# Altium schematic sheet cpu.SchDoc
size A
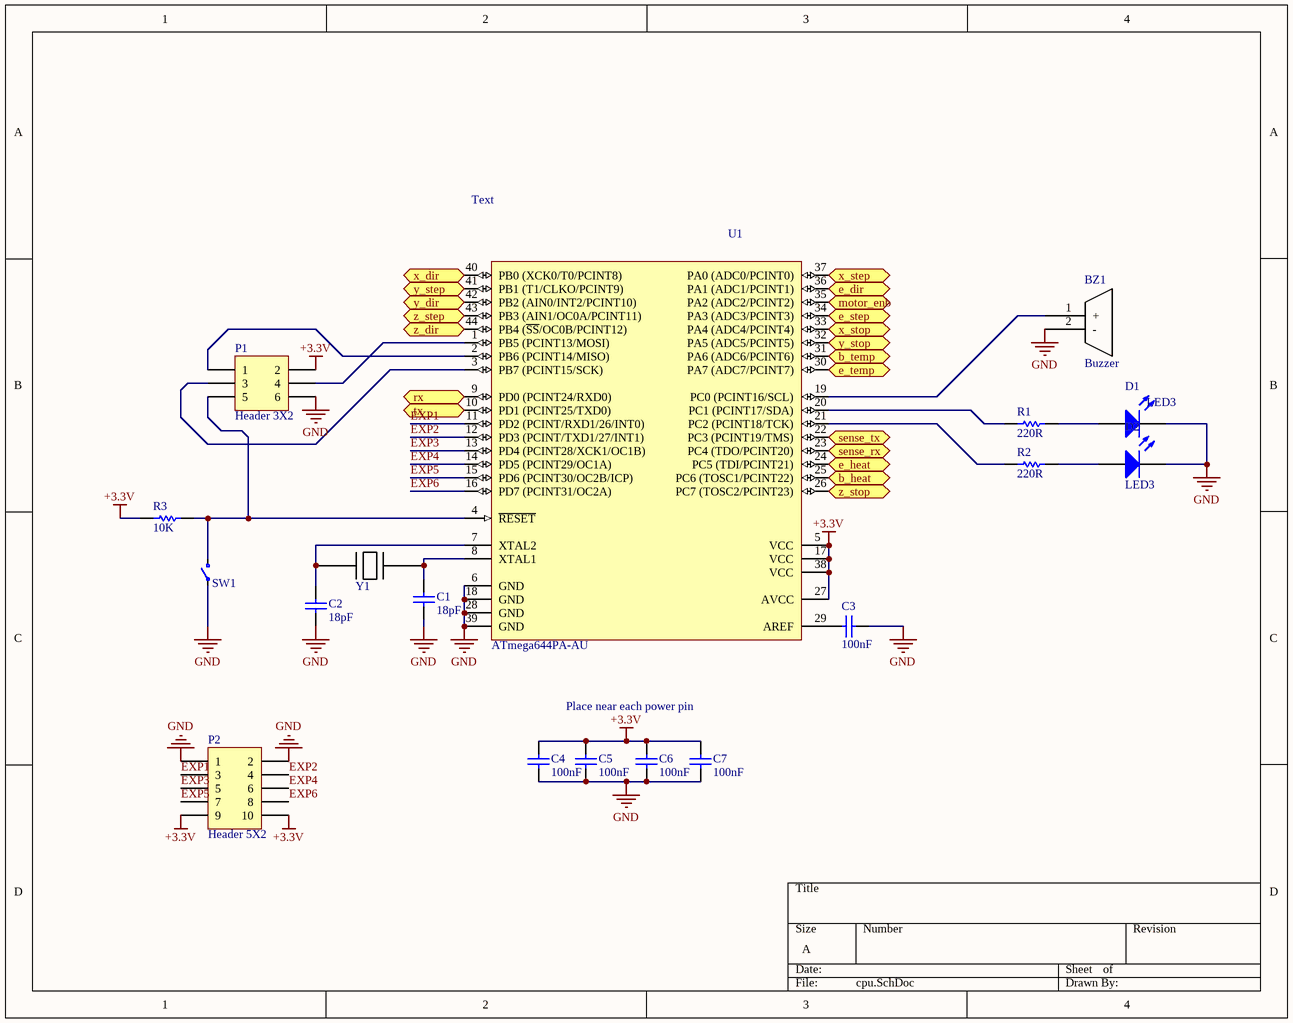
[diagram p0: cpu.SchDoc]

## Parts
BZ1  Buzzer  [buzzer]
C1  value 18pF  [CAPC2012L-3D]  (hidden comment: Cap)
C2  value 18pF  [CAPC2012L-3D]  (hidden comment: Cap)
C3  value 100nF  [1608[0603]]  (hidden comment: Cap)
C4  value 100nF  [1608[0603]]  (hidden comment: Cap)
C5  value 100nF  [1608[0603]]  (hidden comment: Cap)
C6  value 100nF  [1608[0603]]  (hidden comment: Cap)
C7  value 100nF  [1608[0603]]  (hidden comment: Cap)
D1  LED3  [LED 0805]
D2  LED3  [LED 0805]
P1  Header 3X2  [HDR2X3]
P2  Header 5X2  [HDR2X5]
R1  value 220R  [J1-0603]  (hidden comment: Res)
R2  value 220R  [J1-0603]  (hidden comment: Res)
R3  value 10K  [J1-0603]  (hidden comment: Res)
SW1  Tactile Switch 6mm  [Switch 6mm]  (value not drawn)
U1  ATmega644PA-AU  [44A_N]
Y1  ABMM2  [ABMM2]  (value not drawn)

## Ports
b_heat, b_temp, e_dir, e_heat, e_step, e_temp, motor_enb, rx, sense_rx, sense_tx, tx, x_dir, x_step, x_stop, y_dir, y_step, y_stop, z_dir, z_step, z_stop

## Nets
+3.3V: C4.1 C5.1 C6.1 C7.1 P1.2 P2.9 P2.10 R3.2 U1.5(VCC) U1.17(VCC) U1.27(AVCC) U1.38(VCC)
GND: BZ1.2(-) C1.1 C2.1 C3.1 C4.2 C5.2 C6.2 C7.2 D1.2(K) D2.2(K) P1.6 P2.1 P2.2 SW1.1 U1.6(GND) U1.18(GND) U1.28(GND) U1.39(GND) Y1.2 Y1.4
b_heat: U1.25(PC6_(TOSC1/PCINT22)) ; port b_heat
b_temp: U1.31(PA6_(ADC6/PCINT6)) ; port b_temp
e_dir: U1.36(PA1_(ADC1/PCINT1)) ; port e_dir
e_heat: U1.24(PC5_(TDI/PCINT21)) ; port e_heat
e_step: U1.34(PA3_(ADC3/PCINT3)) ; port e_step
e_temp: U1.30(PA7_(ADC7/PCINT7)) ; port e_temp
EXP1: P2.3 U1.11(PD2_(PCINT/RXD1/26/INT0))
EXP2: P2.4 U1.12(PD3_(PCINT/TXD1/27/INT1))
EXP3: P2.5 U1.13(PD4_(PCINT28/XCK1/OC1B))
EXP4: P2.6 U1.14(PD5_(PCINT29/OC1A))
EXP5: P2.7 U1.15(PD6_(PCINT30/OC2B/ICP))
EXP6: P2.8 U1.16(PD7_(PCINT31/OC2A))
motor_enb: U1.35(PA2_(ADC2/PCINT2)) ; port motor_enb
rx: U1.9(PD0_(PCINT24/RXD0)) ; port rx
sense_rx: U1.23(PC4_(TDO/PCINT20)) ; port sense_rx
sense_tx: U1.22(PC3_(PCINT19/TMS)) ; port sense_tx
tx: U1.10(PD1_(PCINT25/TXD0)) ; port tx
x_dir: U1.40(PB0_(XCK0/T0/PCINT8)) ; port x_dir
x_step: U1.37(PA0_(ADC0/PCINT0)) ; port x_step
x_stop: U1.33(PA4_(ADC4/PCINT4)) ; port x_stop
y_dir: U1.42(PB2_(AIN0/INT2/PCINT10)) ; port y_dir
y_step: U1.41(PB1_(T1/CLKO/PCINT9)) ; port y_step
y_stop: U1.32(PA5_(ADC5/PCINT5)) ; port y_stop
z_dir: U1.44(PB4_(~{SS}/OC0B/PCINT12)) ; port z_dir
z_step: U1.43(PB3_(AIN1/OC0A/PCINT11)) ; port z_step
z_stop: U1.26(PC7_(TOSC2/PCINT23)) ; port z_stop
NetBZ1_1: BZ1.1(+) U1.19(PC0_(PCINT16/SCL))
NetC1_2: C1.2 U1.8(XTAL1) Y1.3
NetC2_2: C2.2 U1.7(XTAL2) Y1.1
NetC3_2: C3.2 U1.29(AREF)
NetD1_1: D1.1(A) R1.1
NetD2_1: D2.1(A) R2.1
NetP1_1: P1.1 U1.2(PB6_(PCINT14/MISO))
NetP1_3: P1.3 U1.3(PB7_(PCINT15/SCK))
NetP1_4: P1.4 U1.1(PB5_(PCINT13/MOSI))
NetP1_5: P1.5 R3.1 SW1.2 U1.4(~{RESET})
NetR1_2: R1.2 U1.20(PC1_(PCINT17/SDA))
NetR2_2: R2.2 U1.21(PC2_(PCINT18/TCK))

## Notes on the sheet
- Text
- Place near each power pin

## Library data of the parts
C1-C7 = Cap: Capacitor; Published: 8-Jun-2000; LatestRevisionDate: 17-Jul-2002; LatestRevisionNote: Re-released for DXP Platform.; PackageReference: RAD-0.3; Publisher: Altium Limited; PackageDescription: Radial Cap, Thru-Hole; 2 Leads; 0.3 in Pin Spacing
D1 D2 = LED3: Typical BLUE SiC LED; Published: 8-Jun-2000; LatestRevisionDate: 17-Dec-2003; LatestRevisionNote: PCB Footprint replaced.; DatasheetVersion: 16-Apr-2002; PackageVersion: 16-Apr-2002; PackageReference: 3.5X2.8X1.9; Publisher: Altium Limited; PackageDescription: SM LED; 2 C-Bend Leads; Body 3.5 x 2.8 x 1.9 mm, inc leads (LxWxH typ)
P1 = Header 3X2: Header, 3-Pin, Dual row; LatestRevisionDate: 17-Jul-2002; LatestRevisionNote: Re-released for DXP Platform.; Publisher: Altium Limited
P2 = Header 5X2: Header, 5-Pin, Dual row; LatestRevisionDate: 17-Jul-2002; LatestRevisionNote: Re-released for DXP Platform.; Publisher: Altium Limited
R1-R3 = Res: Resistor 0805; Published: 8-Jun-2000; LatestRevisionDate: 17-Jul-2002; LatestRevisionNote: Re-released for DXP Platform.; PackageReference: AXIAL-0.3; Publisher: Altium Limited; PackageDescription: Axial Device, Thru-Hole; 2 Leads; 0.3 in Pin Spacing
U1 = ATmega644PA-AU: 8-bit AVR Microcontroller, 64KB Flash, 2KB EEPROM, 4KB SRAM, 44-pin TQFP, Industrial Grade (-40°C to 85°C); Published: 1-Apr-2010; DatasheetVersion: revA, Jan-2010; PackageVersion: rev.B, Oct-2001; PackageReference: 44A; Publisher: Altium Limited; PackageDescription: 44-Pin Plastic Thin Profile Quad Flat Pack, 10 x 10 x 1.0 mm Body, 0.8 mm Pitch (TQFP); Supplier 1: Digi-Key; Supplier Part Number 1: ATMEGA644PA-AU-ND; Supplier 2: Mouser; Supplier Part Number 2: 556-ATMEGA644PA-AU; ComponentLink1Description: Manufacturer Link; ComponentLink1URL: http://www.atmel.com/products/avr/default.asp?; ComponentLink2Description: ATmega164A/164PA/324A/324PA/644A/644PA/1284/1284P Datasheet; ComponentLink2URL: http://www.atmel.com/dyn/resources/prod_documents/doc8272.pdf; ComponentLink3Description: ATmega164A/164PA/324A/324PA/644A/644PA/1284/1284P Summary; ComponentLink3URL: http://www.atmel.com/dyn/resources/prod_documents/8272S.pdf; ComponentLink4Description: Atmel.com Home; ComponentLink4URL: http://www.atmel.com